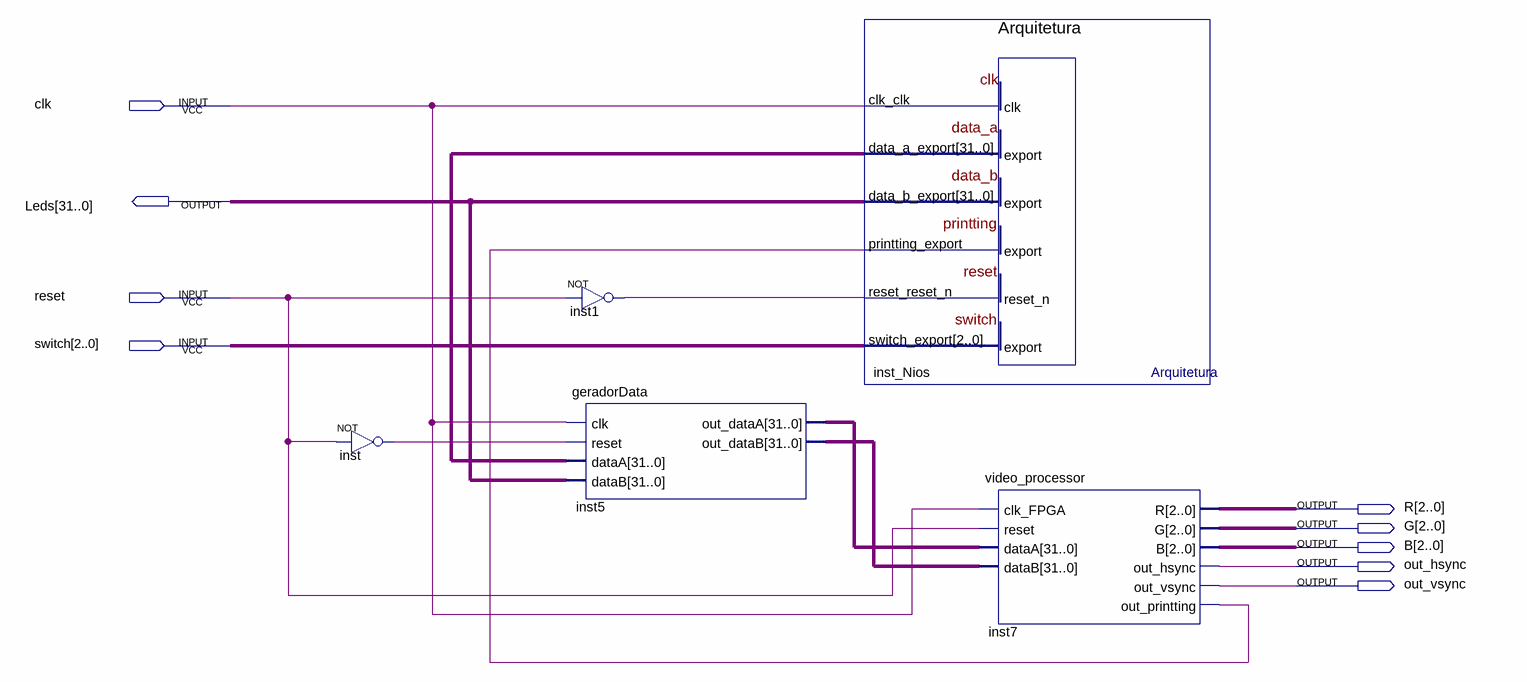
[diagram p0: schematic sheet]
// Quartus schematic ArquiteturaCollenda.bdf as structural Verilog: 5 symbols, 9 pins
module ArquiteturaCollenda (
  input  clk,
  input  reset,
  input  [2:0] switch,
  output [31:0] Leds,
  output [2:0] R,
  output [2:0] G,
  output [2:0] B,
  output out_hsync,
  output out_vsync
);

  wire inst1_out, inst7_out_printting, inst_out;
  wire [31:0] inst5_out_dataa, inst5_out_datab, inst_Nios_data_a_export;

  not inst (inst_out, reset);
  not inst1 (inst1_out, reset);
  geradorData inst5 (
    .clk(clk), .reset(inst_out), .dataA(inst_Nios_data_a_export), .dataB(Leds), .out_dataA(inst5_out_dataa),
    .out_dataB(inst5_out_datab));
  Arquitetura inst_Nios (
    .clk_clk(clk), .printting_export(inst7_out_printting), .reset_reset_n(inst1_out), .switch_export(switch),
    .data_a_export(inst_Nios_data_a_export), .data_b_export(Leds));
  video_processor inst7 (
    .clk_FPGA(clk), .reset(reset), .dataA(inst5_out_dataa), .dataB(inst5_out_datab), .R(R), .G(G), .B(B),
    .out_hsync(out_hsync), .out_vsync(out_vsync), .out_printting(inst7_out_printting));
endmodule
